# Altium schematic sheet HDMI.SchDoc
size D; SheetNumber: 6; SheetTotal: 6
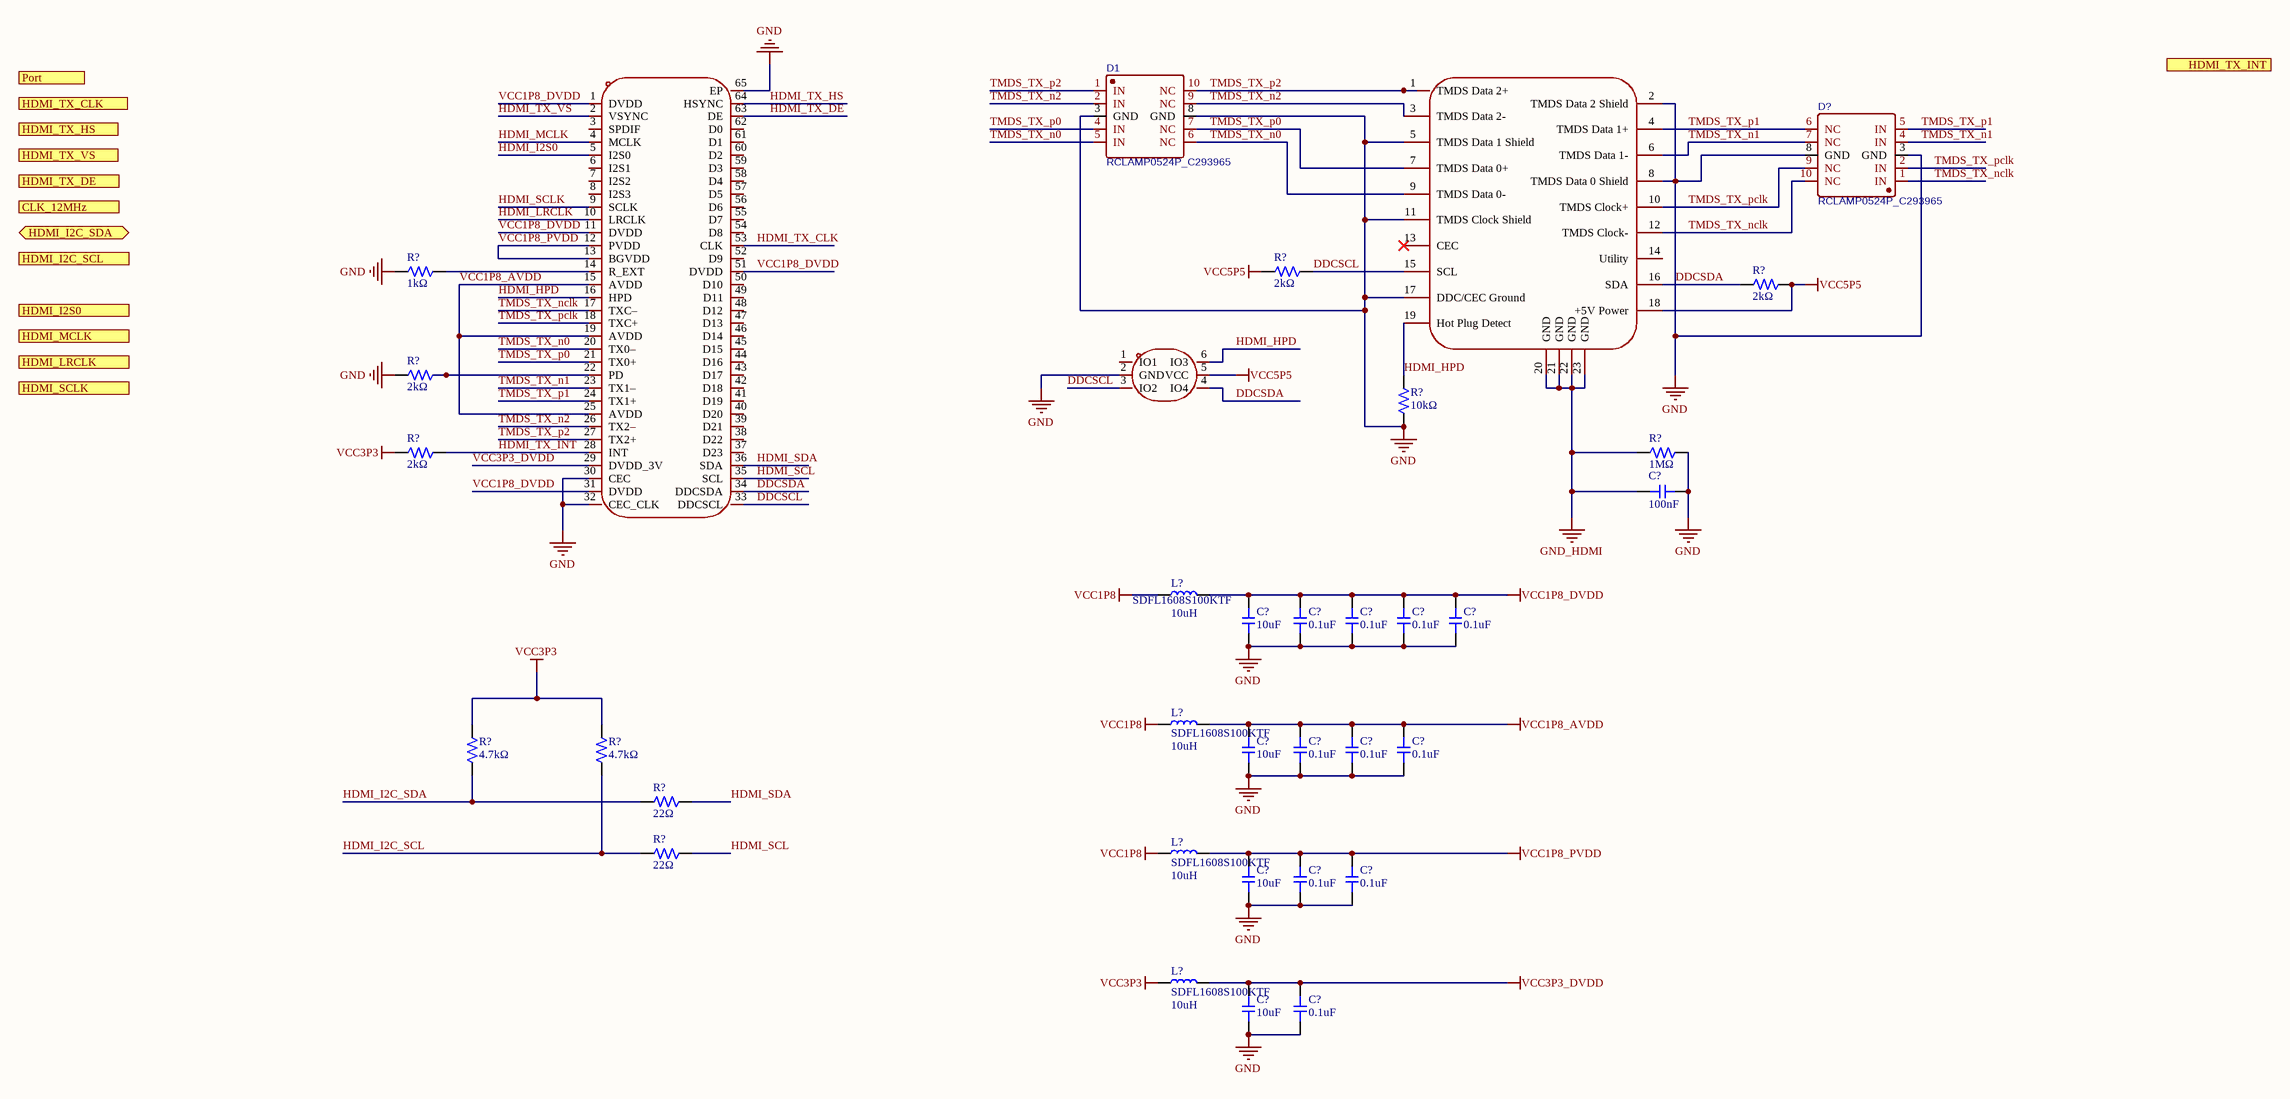
[diagram p0: HDMI.SchDoc]

## Parts
(Parts that share a designator on the sheet are numbered #1, #2 ... from top to bottom, then left to right.)
C?#1  Capacitance: 100nF  [CAP-0402]  (hidden comment: 0402B104M160)
C?#2  Capacitance: 10uF  [CAP-0402]  (hidden comment: 04026D106MAT2A)
C?#3  Capacitance: 0.1uF  (hidden comment: 02016D104KAT2A)
C?#4  Capacitance: 0.1uF  (hidden comment: 02016D104KAT2A)
C?#5  Capacitance: 0.1uF  (hidden comment: 02016D104KAT2A)
C?#6  Capacitance: 0.1uF  (hidden comment: 02016D104KAT2A)
C?#7  Capacitance: 10uF  [CAP-0402]  (hidden comment: 04026D106MAT2A)
C?#8  Capacitance: 0.1uF  (hidden comment: 02016D104KAT2A)
C?#9  Capacitance: 0.1uF  (hidden comment: 02016D104KAT2A)
C?#10  Capacitance: 0.1uF  (hidden comment: 02016D104KAT2A)
C?#11  Capacitance: 10uF  [CAP-0402]  (hidden comment: 04026D106MAT2A)
C?#12  Capacitance: 0.1uF  (hidden comment: 02016D104KAT2A)
C?#13  Capacitance: 0.1uF  (hidden comment: 02016D104KAT2A)
C?#14  Capacitance: 10uF  [CAP-0402]  (hidden comment: 04026D106MAT2A)
C?#15  Capacitance: 0.1uF  (hidden comment: 02016D104KAT2A)
D1  RCLAMP0524P_C293965  [DFN2510-10_L2.5-W1.0-P0.50-BL]
D?#1  RCLAMP0524P_C293965  [DFN2510-10_L2.5-W1.0-P0.50-BL]
D?#2  TPD4E001DBVR  [SOT-23-6_L2.9-W1.6-P0.95-LS2.8-BL]  (value not drawn)
L?#1  SDFL1608S100KTF  Inductance: 10uH  [IND-0603]
L?#2  SDFL1608S100KTF  Inductance: 10uH  [IND-0603]
L?#3  SDFL1608S100KTF  Inductance: 10uH  [IND-0603]
L?#4  SDFL1608S100KTF  Inductance: 10uH  [IND-0603]
R?#1  Resistance: 1kΩ  [RES-0402]  (hidden comment: 0402WGF1001TCE)
R?#2  Resistance: 2kΩ  [RES-0402]  (hidden comment: 0402WGF2001TCE)
R?#3  Resistance: 2kΩ  [RES-0402]  (hidden comment: 0402WGF2001TCE)
R?#4  Resistance: 2kΩ  [RES-0402]  (hidden comment: 0402WGF2001TCE)
R?#5  Resistance: 10kΩ  [RES-0603]  (hidden comment: 0603WAF1002T5E)
R?#6  Resistance: 2kΩ  [RES-0402]  (hidden comment: 0402WGF2001TCE)
R?#7  Resistance: 1MΩ  [RES-0402]  (hidden comment: 0402WGF1004TCE)
R?#8  Resistance: 4.7kΩ  [RES-0402]  (hidden comment: 0402WGF4701TCE)
R?#9  Resistance: 4.7kΩ  [RES-0402]  (hidden comment: 0402WGF4701TCE)
R?#10  Resistance: 22Ω  [RES-0402]  (hidden comment: 0402WGF220JTCE)
R?#11  Resistance: 22Ω  [RES-0402]  (hidden comment: 0402WGF220JTCE)
U?#1  HDMI-232D  [HDMI-232D]  (value not drawn)
U?#2  ADV7513BSWZ  [LQFP-64_L10.0-W10.0-P0.50-LS12.0-BL-EP5.3]  (value not drawn)

## Ports
CLK_12MHz (in), HDMI_I2C_SCL (in), HDMI_I2C_SDA (bidir), HDMI_I2S0 (in), HDMI_LRCLK (in), HDMI_MCLK (in), HDMI_SCLK (in), HDMI_TX_CLK (in), HDMI_TX_DE (in), HDMI_TX_HS (in), HDMI_TX_INT (out), HDMI_TX_VS (in), Port (in)

## Nets
DDCSDA: C?#1.2 C?#2.1 C?#3.1 C?#4.1 C?#5.1 C?#6.1 C?#7.1 C?#8.1 C?#9.1 C?#10.1 C?#11.1 C?#12.1 C?#13.1 C?#14.1 C?#15.1 D1.3(GND) D1.8(GND) D?#1.3(GND) D?#1.8(GND) D?#2.2(GND) D?#2.4(IO4) R?#1.1 R?#3.2 R?#4.1 R?#5.1 R?#7.2 U?#1.2(TMDS_Data_2_Shield) U?#1.5(TMDS_Data_1_Shield) U?#1.8(TMDS_Data_0_Shield) U?#1.11(TMDS_Clock_Shield) U?#1.16(SDA) U?#1.17(DDC/CEC_Ground) U?#2.30(CEC) U?#2.32(CEC_CLK) U?#2.34(DDCSDA) U?#2.65(EP)  [also labelled GND]
GND_HDMI: C?#1.1 R?#7.1 U?#1.20(GND) U?#1.21(GND) U?#1.22(GND) U?#1.23(GND)
VCC1P8: L?#1.1 L?#2.1 L?#3.1
VCC1P8_AVDD: C?#7.2 C?#8.2 C?#9.2 C?#10.2 L?#2.2 U?#2.15(AVDD) U?#2.19(AVDD) U?#2.25(AVDD)
VCC1P8_DVDD: C?#2.2 C?#3.2 C?#4.2 C?#5.2 C?#6.2 L?#1.2 U?#2.1(DVDD) U?#2.11(DVDD) U?#2.31(DVDD) U?#2.51(DVDD)
VCC1P8_PVDD: C?#11.2 C?#12.2 C?#13.2 L?#3.2 U?#2.12(PVDD) U?#2.13(BGVDD)
VCC3P3: L?#4.1 R?#6.1 R?#8.2 R?#9.2
VCC3P3_DVDD: C?#14.2 C?#15.2 L?#4.2 U?#2.29(DVDD_3V)
VCC5P5: D?#2.5(VCC) R?#2.2 R?#3.1 U?#1.18(+5V_Power)
DDCSCL: D?#2.3(IO2) R?#2.1 U?#1.15(SCL) U?#2.33(DDCSCL)
HDMI_HPD: D?#2.6(IO3) R?#5.2 U?#1.19(Hot_Plug_Detect) U?#2.16(HPD)
HDMI_I2C_SCL: R?#9.1 R?#11.1
HDMI_I2C_SDA: R?#8.1 R?#10.1
HDMI_I2S0: U?#2.5(I2S0)
HDMI_LRCLK: U?#2.10(LRCLK)
HDMI_MCLK: U?#2.4(MCLK)
HDMI_SCL: R?#11.2 U?#2.35(SCL)
HDMI_SCLK: U?#2.9(SCLK)
HDMI_SDA: R?#10.2 U?#2.36(SDA)
HDMI_TX_CLK: U?#2.53(CLK)
HDMI_TX_DE: U?#2.63(DE)
HDMI_TX_HS: U?#2.64(HSYNC)
HDMI_TX_INT: R?#6.2 U?#2.28(INT)
HDMI_TX_VS: U?#2.2(VSYNC)
TMDS_TX_n0: D1.5(IN) D1.6(NC) U?#1.9(TMDS_Data_0-) U?#2.20(TX0–)
TMDS_TX_n1: D?#1.4(IN) D?#1.7(NC) U?#1.6(TMDS_Data_1-) U?#2.23(TX1–)
TMDS_TX_n2: D1.2(IN) D1.9(NC) U?#1.3(TMDS_Data_2-) U?#2.26(TX2–)
TMDS_TX_nclk: D?#1.1(IN) D?#1.10(NC) U?#1.12(TMDS_Clock-) U?#2.17(TXC–)
TMDS_TX_p0: D1.4(IN) D1.7(NC) U?#1.7(TMDS_Data_0+) U?#2.21(TX0+)
TMDS_TX_p1: D?#1.5(IN) D?#1.6(NC) U?#1.4(TMDS_Data_1+) U?#2.24(TX1+)
TMDS_TX_p2: D1.1(IN) D1.10(NC) U?#1.1(TMDS_Data_2+) U?#2.27(TX2+)
TMDS_TX_pclk: D?#1.2(IN) D?#1.9(NC) U?#1.10(TMDS_Clock+) U?#2.18(TXC+)
NetR?#1_2: R?#1.2 U?#2.14(R_EXT)
NetR?#4_2: R?#4.2 U?#2.22(PD)

Not connected (* = marked no-connect by the designer): D?#2 1(IO1); U?#1 13(CEC)* 14(Utility); U?#2 3(SPDIF) 6(I2S1) 7(I2S2) 8(I2S3) 37(D23) 38(D22) 39(D21) 40(D20) 41(D19) 42(D18) 43(D17) 44(D16) 45(D15) 46(D14) 47(D13) 48(D12) 49(D11) 50(D10) 52(D9) 54(D8) 55(D7) 56(D6) 57(D5) 58(D4) 59(D3) 60(D2) 61(D1) 62(D0)

## Library data of the parts
C?#1 = 0402B104M160: Capacitor, Ceramic (MLCC), 100nF, ±20%, 16V, X7R, ±20%, SMD 0402; Manufacturer: Walsin Tech Corp; Package Size: 0402; JLCPCB Basic Part: No; JLCPCB Part Number: C163181; Supplier 1: LCSC; Category: Capacitors - MLCC; Supplier Part Number 1: C163181; Manufacturer Part Number: 0402B104M160; Tolerance: ±20%; Voltage Rating: 16V; Temperature Coefficient: X7R; RoHS: Yes; ComponentLink1Description: Datasheet; ComponentLink1URL: https://wmsc.lcsc.com/wmsc/upload/file/pdf/v2/lcsc/2304140030_Walsin-Tech-Corp-0402B104M160_C163181.pdf; ComponentLink2Description: JLCPCB Part URL; ComponentLink2URL: https://jlcpcb.com/partdetail/C163181; ComponentLink3Description: LCSC Part URL; ComponentLink3URL: https://lcsc.com/product-detail/Multilayer-Ceramic-Capacitors-MLCC---SMD-SMT_Walsin-Tech-Corp-Walsin-Tech-Corp-0402B104M160_C163181.html
C?#2 C?#7 C?#11 C?#14 = 04026D106MAT2A: Capacitor, Ceramic (MLCC), 10uF, ±20%, 6.3V, X5R, ±20%, SMD 0402; Manufacturer: Kyocera AVX; Package Size: 0402; JLCPCB Basic Part: No; JLCPCB Part Number: C2178725; Supplier 1: LCSC; Category: Capacitors - MLCC; Supplier Part Number 1: C2178725; Manufacturer Part Number: 04026D106MAT2A; Tolerance: ±20%; Voltage Rating: 6.3V; Temperature Coefficient: X5R; RoHS: Yes; ComponentLink1Description: Datasheet; ComponentLink1URL: https://wmsc.lcsc.com/wmsc/upload/file/pdf/v2/lcsc/2304140030_Kyocera-AVX-04026D106MAT2A_C2178725.pdf; ComponentLink2Description: JLCPCB Part URL; ComponentLink2URL: https://jlcpcb.com/partdetail/C2178725; ComponentLink3Description: LCSC Part URL; ComponentLink3URL: https://lcsc.com/product-detail/Multilayer-Ceramic-Capacitors-MLCC---SMD-SMT_Kyocera-AVX-Kyocera-AVX-04026D106MAT2A_C2178725.html
C?#3-C?#6 C?#8-C?#10 C?#12 C?#13 C?#15 = 02016D104KAT2A: Capacitor, Ceramic (MLCC), 0.1uF, ±10%, 6.3V, X5R, ±10%, SMD 0201; Manufacturer: Kyocera AVX; Package Size: 0201; JLCPCB Basic Part: No; JLCPCB Part Number: C5188607; Supplier 1: LCSC; Category: Capacitors - MLCC; Supplier Part Number 1: C5188607; Manufacturer Part Number: 02016D104KAT2A; Tolerance: ±10%; Voltage Rating: 6.3V; Temperature Coefficient: X5R; RoHS: Yes; ComponentLink1Description: Datasheet; ComponentLink1URL: https://wmsc.lcsc.com/wmsc/upload/file/pdf/v2/lcsc/2309151050_Kyocera-AVX-02016D104KAT2A_C5188607.pdf; ComponentLink2Description: JLCPCB Part URL; ComponentLink2URL: https://jlcpcb.com/partdetail/C5188607; ComponentLink3Description: LCSC Part URL; ComponentLink3URL: https://lcsc.com/product-detail/Multilayer-Ceramic-Capacitors-MLCC---SMD-SMT_Kyocera-AVX-Kyocera-AVX-02016D104KAT2A_C5188607.html
D1 D?#1 = RCLAMP0524P_C293965: Manufacturer: DOWO(东沃); Contributor: LCSC; Supplier: LCSC; Supplier Part: C293965; Manufacturer Part: RCLAMP0524P; JLCPCB Part Class: Extended Part; spicePre: D; spiceSymbolName: RCLAMP0524P_C293965
D?#2 = TPD4E001DBVR: Manufacturer: TI(德州仪器); Add into BOM: yes; Reverse Stand-Off Voltage (Vrwm): 5.5V; Peak Pulse Power Dissipation (Ppp)@10/1000us: 100W; Breakdown Voltage: 11V; Type: ESD; Symbol: TPD4E001DBVR; Device: TPD4E001DBVR; LCSC Part Name: TPD4E001DBVR; Supplier Part: C465736; Manufacturer Part: TPD4E001DBVR; Supplier Footprint: SOT-23-6; JLCPCB Part Class: Extended Part; Datasheet: https://www.ti.com/cn/lit/gpn/tpd4e001; Supplier: LCSC; Convert to PCB: yes; Maximum Clamping Voltage: -; Operating Temperature: -40℃~+85℃@(Ta)
L?#1-L?#4 = SDFL1608S100KTF: Inductor, 10uH, ±10%, 1.85Ω, 3mA, SMD 0603; Manufacturer: Sunlord; Self-Resonant Frequency: 2MHz; Q Factor: 30@2MHz; Package Size: 0603; JLCPCB Basic Part: Yes; JLCPCB Part Number: C1035; Supplier 1: LCSC; Category: Inductors; Supplier Part Number 1: C1035; Manufacturer Part Number: SDFL1608S100KTF; Tolerance: ±10%; Rated Current: 3mA; DC Resistance: 1.85Ω; RoHS: Yes; ComponentLink1Description: Datasheet; ComponentLink1URL: https://wmsc.lcsc.com/wmsc/upload/file/pdf/v2/lcsc/2310301641_Sunlord-SDFL1608S100KTF_C1035.pdf; ComponentLink2Description: JLCPCB Part URL; ComponentLink2URL: https://jlcpcb.com/partdetail/C1035; ComponentLink3Description: LCSC Part URL; ComponentLink3URL: https://lcsc.com/product-detail/Inductors-SMD_Sunlord-Sunlord-SDFL1608S100KTF_C1035.html
R?#1 = 0402WGF1001TCE: Resistor, 1kΩ, ±1%, 62.5mW, 50V, ±100ppm/℃, -55℃~+155℃, SMD 0402; Manufacturer: Uniroyal; Supplier 1: LCSC; Manufacturer Part Number: 0402WGF1001TCE; Supplier Part Number 1: C11702; JLCPCB Part Number: C11702; Power Rating: 62.5mW; Category: Resistors; Package Size: 0402; JLCPCB Basic Part: Yes; Tolerance: ±1%; Voltage Rating: 50V; Temperature Coefficient: ±100ppm/℃; Temperature Rating: -55℃~+155℃; ComponentLink1Description: Datasheet; ComponentLink1URL: https://wmsc.lcsc.com/wmsc/upload/file/pdf/v2/lcsc/2206010216_UNI-ROYAL-Uniroyal-Elec-0402WGF1001TCE_C11702.pdf; ComponentLink2Description: JLCPCB Part URL; ComponentLink2URL: https://jlcpcb.com/partdetail/C11702
R?#2-R?#4 R?#6 = 0402WGF2001TCE: Resistor, 2kΩ, ±1%, 62.5mW, 50V, ±100ppm/℃, -55℃~+155℃, SMD 0402; Manufacturer: Uniroyal; Supplier 1: LCSC; Manufacturer Part Number: 0402WGF2001TCE; Supplier Part Number 1: C4109; JLCPCB Part Number: C4109; Power Rating: 62.5mW; Category: Resistors; Package Size: 0402; JLCPCB Basic Part: Yes; Tolerance: ±1%; Voltage Rating: 50V; Temperature Coefficient: ±100ppm/℃; Temperature Rating: -55℃~+155℃; ComponentLink1Description: Datasheet; ComponentLink1URL: https://wmsc.lcsc.com/wmsc/upload/file/pdf/v2/lcsc/2206010230_UNI-ROYAL-Uniroyal-Elec-0402WGF2001TCE_C4109.pdf; ComponentLink2Description: JLCPCB Part URL; ComponentLink2URL: https://jlcpcb.com/partdetail/C4109
R?#5 = 0603WAF1002T5E: Resistor, 10kΩ, ±1%, 100mW, 75V, ±100ppm/℃, -55℃~+155℃, SMD 0603; Manufacturer: Uniroyal; Supplier 1: LCSC; Manufacturer Part Number: 0603WAF1002T5E; Supplier Part Number 1: C25804; JLCPCB Part Number: C25804; Power Rating: 100mW; Category: Resistors; Package Size: 0603; JLCPCB Basic Part: Yes; Tolerance: ±1%; Voltage Rating: 75V; Temperature Coefficient: ±100ppm/℃; Temperature Rating: -55℃~+155℃; ComponentLink1Description: Datasheet; ComponentLink1URL: https://wmsc.lcsc.com/wmsc/upload/file/pdf/v2/lcsc/2206010045_UNI-ROYAL-Uniroyal-Elec-0603WAF1002T5E_C25804.pdf; ComponentLink2Description: JLCPCB Part URL; ComponentLink2URL: https://jlcpcb.com/partdetail/C25804
R?#7 = 0402WGF1004TCE: Resistor, 1MΩ, ±1%, 62.5mW, 50V, ±100ppm/℃, -55℃~+155℃, SMD 0402; Manufacturer: Uniroyal; Supplier 1: LCSC; Manufacturer Part Number: 0402WGF1004TCE; Supplier Part Number 1: C26083; JLCPCB Part Number: C26083; Power Rating: 62.5mW; Category: Resistors; Package Size: 0402; JLCPCB Basic Part: Yes; Tolerance: ±1%; Voltage Rating: 50V; Temperature Coefficient: ±100ppm/℃; Temperature Rating: -55℃~+155℃; ComponentLink1Description: Datasheet; ComponentLink1URL: https://wmsc.lcsc.com/wmsc/upload/file/pdf/v2/lcsc/2206010030_UNI-ROYAL-Uniroyal-Elec-0402WGF1004TCE_C26083.pdf; ComponentLink2Description: JLCPCB Part URL; ComponentLink2URL: https://jlcpcb.com/partdetail/C26083
R?#8 R?#9 = 0402WGF4701TCE: Resistor, 4.7kΩ, ±1%, 62.5mW, 50V, ±100ppm/℃, -55℃~+155℃, SMD 0402; Manufacturer: Uniroyal; Supplier 1: LCSC; Manufacturer Part Number: 0402WGF4701TCE; Supplier Part Number 1: C25900; JLCPCB Part Number: C25900; Power Rating: 62.5mW; Category: Resistors; Package Size: 0402; JLCPCB Basic Part: Yes; Tolerance: ±1%; Voltage Rating: 50V; Temperature Coefficient: ±100ppm/℃; Temperature Rating: -55℃~+155℃; ComponentLink1Description: Datasheet; ComponentLink1URL: https://wmsc.lcsc.com/wmsc/upload/file/pdf/v2/lcsc/2206010045_UNI-ROYAL-Uniroyal-Elec-0402WGF4701TCE_C25900.pdf; ComponentLink2Description: JLCPCB Part URL; ComponentLink2URL: https://jlcpcb.com/partdetail/C25900
R?#10 R?#11 = 0402WGF220JTCE: Resistor, 22Ω, ±1%, 62.5mW, 50V, ±200ppm/℃, -55℃~+155℃, SMD 0402; Manufacturer: Uniroyal; Supplier 1: LCSC; Manufacturer Part Number: 0402WGF220JTCE; Supplier Part Number 1: C25092; JLCPCB Part Number: C25092; Power Rating: 62.5mW; Category: Resistors; Package Size: 0402; JLCPCB Basic Part: Yes; Tolerance: ±1%; Voltage Rating: 50V; Temperature Coefficient: ±200ppm/℃; Temperature Rating: -55℃~+155℃; ComponentLink1Description: Datasheet; ComponentLink1URL: https://wmsc.lcsc.com/wmsc/upload/file/pdf/v2/lcsc/2205311900_UNI-ROYAL-Uniroyal-Elec-0402WGF220JTCE_C25092.pdf; ComponentLink2Description: JLCPCB Part URL; ComponentLink2URL: https://jlcpcb.com/partdetail/C25092
U?#1 = HDMI-232D: Manufacturer: HANBO(汉博); Add into BOM: yes; Symbol: HDMI-232D; Device: HDMI-232D; LCSC Part Name: HDMI TYPE A型短体壳长9.5; Supplier Part: C47326463; Manufacturer Part: HDMI-232D; Supplier Footprint: SMD; JLCPCB Part Class: Extended Part; Datasheet: https://item.szlcsc.com/datasheet/HDMI-232D/49535968.html; Supplier: LCSC; Convert to PCB: yes
U?#2 = ADV7513BSWZ: Manufacturer: ADI(亚德诺); Add into BOM: yes; Control Interface: I2C; Voltage - Supply: 1.8V；3.3V; Symbol: ADV7513BSWZ; Device: ADV7513BSWZ; LCSC Part Name: ADV7513 HDMI 发送器; Supplier Part: C408901; Manufacturer Part: ADV7513BSWZ; Supplier Footprint: LQFP-64(10x10); JLCPCB Part Class: Extended Part; Datasheet: https://item.szlcsc.com/datasheet/ADV7513BSWZ/398368.html; Supplier: LCSC; Convert to PCB: yes; Type: -; Operating Temperature: -25℃~+85℃